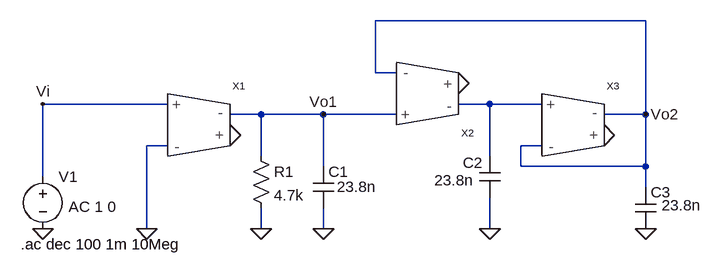
[diagram p0: schematic Filtro OTAS.asc]
Filtro OTAS.asc, the LTspice schematic file:
Version 4
SHEET 1 1064 680
WIRE 880 -16 464 -16
WIRE 464 64 464 -16
WIRE 496 64 464 64
WIRE 144 112 -48 112
WIRE 640 112 592 112
WIRE 720 112 640 112
WIRE 288 128 240 128
WIRE 384 128 288 128
WIRE 496 128 384 128
WIRE 880 128 880 -16
WIRE 880 128 816 128
WIRE 144 176 112 176
WIRE 720 176 688 176
WIRE 288 192 288 128
WIRE 640 192 640 112
WIRE 384 208 384 128
WIRE 688 208 688 176
WIRE 880 208 880 128
WIRE 880 208 688 208
WIRE -48 224 -48 112
WIRE 880 240 880 208
WIRE 112 304 112 176
WIRE 288 304 288 272
WIRE 384 304 384 272
WIRE 640 304 640 256
FLAG 240 160 0
FLAG 816 160 0
FLAG 112 304 0
FLAG 288 304 0
FLAG 384 304 0
FLAG 880 304 0
FLAG -48 304 0
FLAG 592 80 0
FLAG 640 304 0
FLAG -48 112 Vi
FLAG 880 128 Vo2
FLAG 384 128 Vo1
SYMBOL OTAdif 224 144 R0
SYMATTR InstName X1
SYMATTR SpiceLine gm=212u
SYMBOL OTAdif 800 144 R0
SYMATTR InstName X3
SYMATTR SpiceLine gm=212u
SYMBOL res 272 176 R0
SYMATTR InstName R1
SYMATTR Value 4.7k
SYMBOL cap 368 208 R0
WINDOW 3 37 31 Left 2
SYMATTR InstName C1
SYMATTR Value 23.8n
SYMBOL cap 624 192 R0
WINDOW 0 -25 10 Left 2
WINDOW 3 -69 37 Left 2
SYMATTR InstName C2
SYMATTR Value 23.8n
SYMBOL cap 864 240 R0
WINDOW 3 41 28 Left 2
SYMATTR InstName C3
SYMATTR Value 23.8n
SYMBOL voltage -48 208 R0
WINDOW 123 40 62 Left 2
WINDOW 39 0 0 Left 0
SYMATTR InstName V1
SYMATTR Value ""
SYMATTR Value2 AC 1 0
SYMBOL OTAdif 576 96 M180
SYMATTR InstName X2
SYMATTR SpiceLine gm=212u
TEXT -82 328 Left 2 !.ac dec 100 1m 10Meg

The netlist it stands for:
* Filtro OTAS.asc
XX1 Vi 0 Vo1 0 OTAdif params: gm=212u  ; pins V+ V- Io- Io+
XX3 N001 Vo2 Vo2 0 OTAdif params: gm=212u  ; pins V+ V- Io- Io+
R1 Vo1 0 4.7k
C1 Vo1 0 23.8n
C2 N001 0 23.8n
C3 Vo2 0 23.8n
V1 Vi 0 AC 1 0
XX2 Vo1 Vo2 N001 0 OTAdif params: gm=212u  ; pins V+ V- Io- Io+
.ac dec 100 1m 10Meg
.backanno
.end